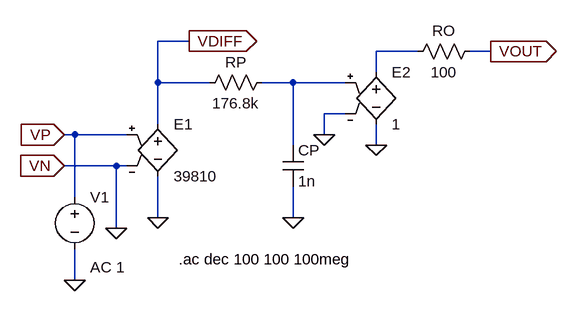
[diagram p0: schematic fig-02-02-02.asc]
fig-02-02-02.asc, the LTspice schematic file:
Version 4
SHEET 1 1740 680
WIRE 192 0 144 0
WIRE 544 16 480 16
WIRE 656 16 624 16
WIRE 480 48 480 16
WIRE 144 64 144 0
WIRE 224 64 144 64
WIRE 352 64 304 64
WIRE 432 64 352 64
WIRE 432 112 400 112
WIRE 144 128 144 64
WIRE 16 144 0 144
WIRE 96 144 16 144
WIRE 400 144 400 112
WIRE 352 160 352 64
WIRE 480 160 480 128
WIRE 80 192 0 192
WIRE 96 192 80 192
WIRE 16 240 16 144
WIRE 144 272 144 208
WIRE 352 272 352 224
WIRE 80 288 80 192
WIRE 16 368 16 320
FLAG 144 272 0
FLAG 16 368 0
FLAG 352 272 0
FLAG 400 144 0
FLAG 480 160 0
FLAG 80 288 0
FLAG 656 16 VOUT
IOPIN 656 16 Out
FLAG 0 144 VP
IOPIN 0 144 In
FLAG 0 192 VN
IOPIN 0 192 In
FLAG 192 0 VDIFF
IOPIN 192 0 Out
SYMBOL e 144 112 R0
SYMATTR InstName E1
SYMATTR Value 39810
SYMBOL voltage 16 224 R0
WINDOW 123 24 124 Left 2
WINDOW 39 0 0 Left 0
SYMATTR Value2 AC 1
SYMATTR InstName V1
SYMATTR Value ""
SYMBOL res 320 48 R90
WINDOW 0 0 56 VBottom 2
WINDOW 3 32 56 VTop 2
SYMATTR InstName RP
SYMATTR Value 176.8k
SYMBOL cap 336 160 R0
SYMATTR InstName CP
SYMATTR Value 1n
SYMBOL e 480 32 R0
SYMATTR InstName E2
SYMATTR Value 1
SYMBOL res 640 0 R90
WINDOW 0 0 56 VBottom 2
WINDOW 3 32 56 VTop 2
SYMATTR InstName RO
SYMATTR Value 100
TEXT 176 336 Left 2 !.ac dec 100 100 100meg

The netlist it stands for:
* fig-02-02-02.asc
E1 VDIFF 0 VP 0 39810
V1 VP 0 AC 1
RP N002 VDIFF 176.8k
CP N002 0 1n
E2 N001 0 N002 0 1
RO VOUT N001 100
.ac dec 100 100 100meg
.backanno
.end